# EAGLE design CAN Cape v2.1 (EAGLE 6.2)

## Sheet 1 of 3: Beagle Bone Black
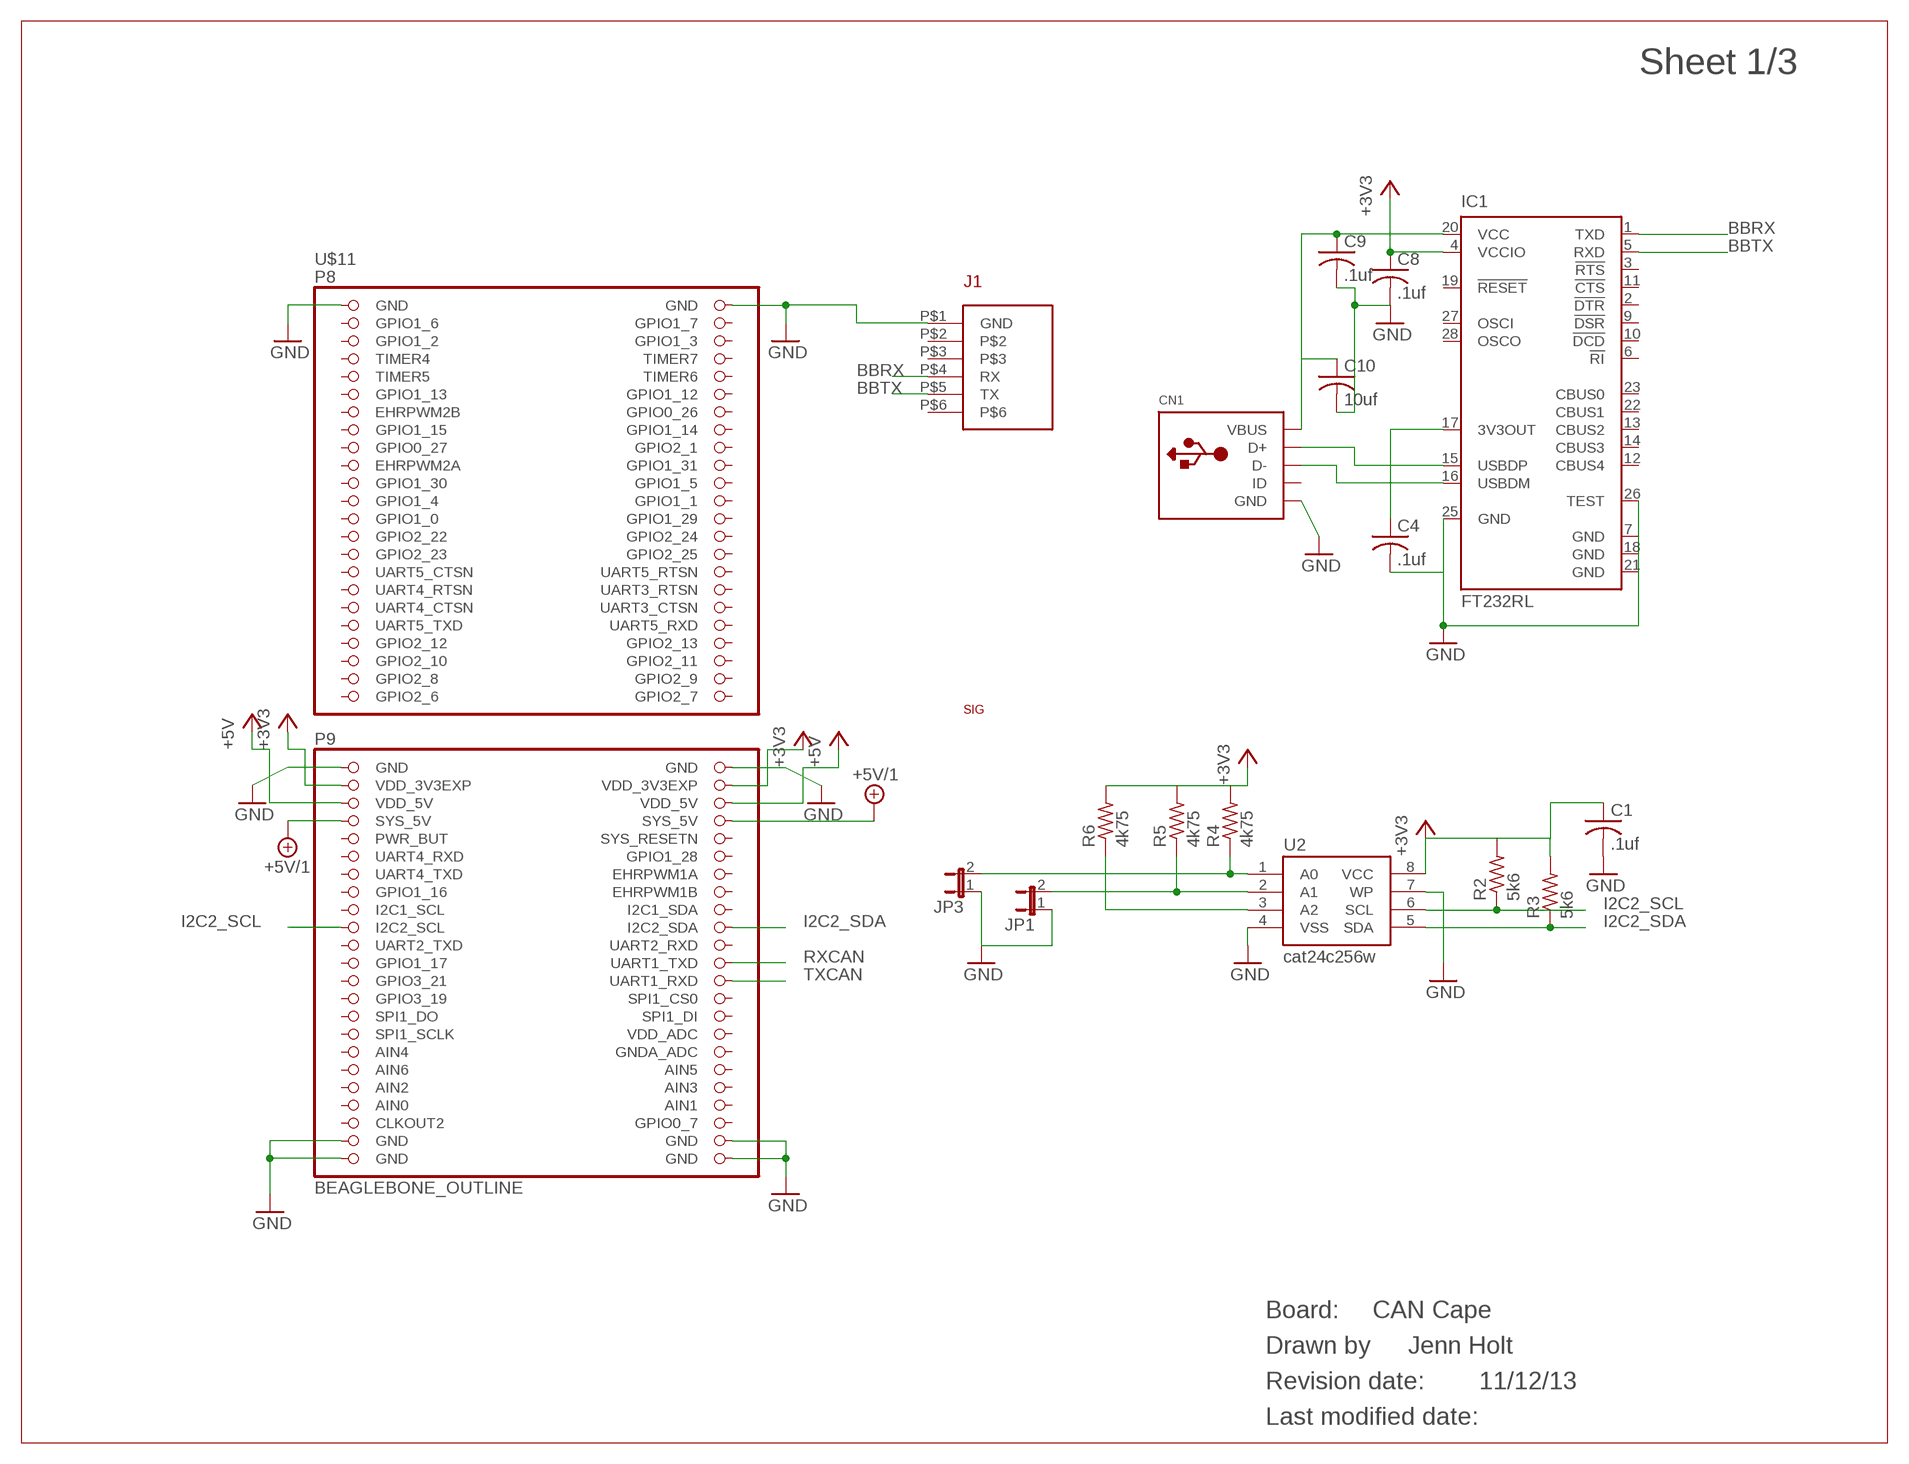
[diagram p0: schematic, sheet 1]

### Parts
C1  .1uf  C-USC0603  [C0603]
C4  .1uf  C-USC0603  [C0603]
C8  .1uf  C-USC0603  [C0603]
C9  .1uf  C-USC0603  [C0603]
C10  10uf  C-USC0805  [C0805]
CN1  USBMINIB  [USB-MINIB]
IC1  FT232RL  [SSOP28]
JP1  JUMPER-2SMD-NO  [SJ_2S-NO]
JP3  JUMPER-2SMD-NO  [SJ_2S-NO]
R2  5k6  R-US_R0603  [R0603]
R3  5k6  R-US_R0603  [R0603]
R4  4k75  R-US_R0603  [R0603]
R5  4k75  R-US_R0603  [R0603]
R6  4k75  R-US_R0603  [R0603]
U2  cat24c256w  EEPROM-I2CSMD  [SO08]
U$5  SIG  [SIG]
U$10  CURRENT-C-LETTER-LANDSCAPE  [BLANK]
U$11  BEAGLEBONE_OUTLINE  [BEAGLEBONE_SHIELD]

### Nets
+3V3: C1.1 C8.1 IC1.4(VCCIO) R2.2 R3.2 R4.2 R5.2 R6.2 U2.8(VCC) U$11.49(VDD_3V3EXP) U$11.50(VDD_3V3EXP) ; also sheet 2,3
+5V: U$11.51(VDD_5V) U$11.52(VDD_5V) ; also sheet 3
+5V/1: U$11.53(SYS_5V) U$11.54(SYS_5V)
A0: JP3.2 R4.1 U2.1(A0)
A1: JP1.2 R5.1 U2.2(A1)
BBRX: IC1.1(TXD) U$11.P$4(RX)
BBTX: IC1.5(RXD) U$11.P$5(TX)
GND: C1.2 C4.2 C8.2 C9.2 C10.2 CN1.GND IC1.7(GND) IC1.18(GND) IC1.21(GND) IC1.25(GND) IC1.26(TEST) JP1.1 JP3.1 U2.4(VSS) U2.7(WP) U$11.1(GND) U$11.2(GND) U$11.47(GND) U$11.48(GND) U$11.89(GND) U$11.90(GND) U$11.91(GND) U$11.92(GND) U$11.P$1(GND) ; also sheet 2,3
I2C2_SCL: R2.1 U2.6(SCL) U$11.65(I2C2_SCL)
I2C2_SDA: R3.1 U2.5(SDA) U$11.66(I2C2_SDA)
N$2: C9.1 C10.1 CN1.VBUS IC1.20(VCC)
N$4: CN1.D+ IC1.15(USBDP)
N$5: CN1.D- IC1.16(USBDM)
N$6: R6.1 U2.3(A2)
N$8: C4.1 IC1.17(3V3OUT)
RXCAN: U$11.70(UART1_TXD) ; also sheet 2
TXCAN: U$11.72(UART1_RXD) ; also sheet 2
Unconnected: CN1.ID IC1.2(!DTR) IC1.3(!RTS) IC1.6(!RI) IC1.9(!DSR) IC1.10(!DCD) IC1.11(!CTS) IC1.12(CBUS4) IC1.13(CBUS2) IC1.14(CBUS3) IC1.19(!RESET) IC1.22(CBUS1) IC1.23(CBUS0) IC1.27(OSCI) IC1.28(OSCO) U$11.3(GPIO1_6) U$11.4(GPIO1_7) U$11.5(GPIO1_2) U$11.6(GPIO1_3) U$11.7(TIMER4) U$11.8(TIMER7) U$11.9(TIMER5) U$11.10(TIMER6) U$11.11(GPIO1_13) U$11.12(GPIO1_12) U$11.13(EHRPWM2B) U$11.14(GPIO0_26) U$11.15(GPIO1_15) U$11.16(GPIO1_14) U$11.17(GPIO0_27) U$11.18(GPIO2_1) U$11.19(EHRPWM2A) U$11.20(GPIO1_31) U$11.21(GPIO1_30) U$11.22(GPIO1_5) U$11.23(GPIO1_4) U$11.24(GPIO1_1) U$11.25(GPIO1_0) U$11.26(GPIO1_29) U$11.27(GPIO2_22) U$11.28(GPIO2_24) U$11.29(GPIO2_23) U$11.30(GPIO2_25) U$11.31(UART5_CTSN) U$11.32(UART5_RTSN) U$11.33(UART4_RTSN) U$11.34(UART3_RTSN) U$11.35(UART4_CTSN) U$11.36(UART3_CTSN) U$11.37(UART5_TXD) U$11.38(UART5_RXD) U$11.39(GPIO2_12) U$11.40(GPIO2_13) U$11.41(GPIO2_10) U$11.42(GPIO2_11) U$11.43(GPIO2_8) U$11.44(GPIO2_9) U$11.45(GPIO2_6) U$11.46(GPIO2_7) U$11.55(PWR_BUT) U$11.56(SYS_RESETN) U$11.57(UART4_RXD) U$11.58(GPIO1_28) U$11.59(UART4_TXD) U$11.60(EHRPWM1A) U$11.61(GPIO1_16) U$11.62(EHRPWM1B) U$11.63(I2C1_SCL) U$11.64(I2C1_SDA) U$11.67(UART2_TXD) U$11.68(UART2_RXD) U$11.69(GPIO1_17) U$11.71(GPIO3_21) U$11.73(GPIO3_19) U$11.74(SPI1_CS0) U$11.75(SPI1_DO) U$11.76(SPI1_DI) U$11.77(SPI1_SCLK) U$11.78(VDD_ADC) U$11.79(AIN4) U$11.80(GNDA_ADC) U$11.81(AIN6) U$11.82(AIN5) U$11.83(AIN2) U$11.84(AIN3) U$11.86(AIN1) U$11.87(CLKOUT2) U$11.88(GPIO0_7) U$11.P$2 U$11.P$3 U$11.P$6

### Notes on the sheet
- CAN Cape
- Jenn Holt
- 11/12/13

## Sheet 2 of 3: CAN and Connectors
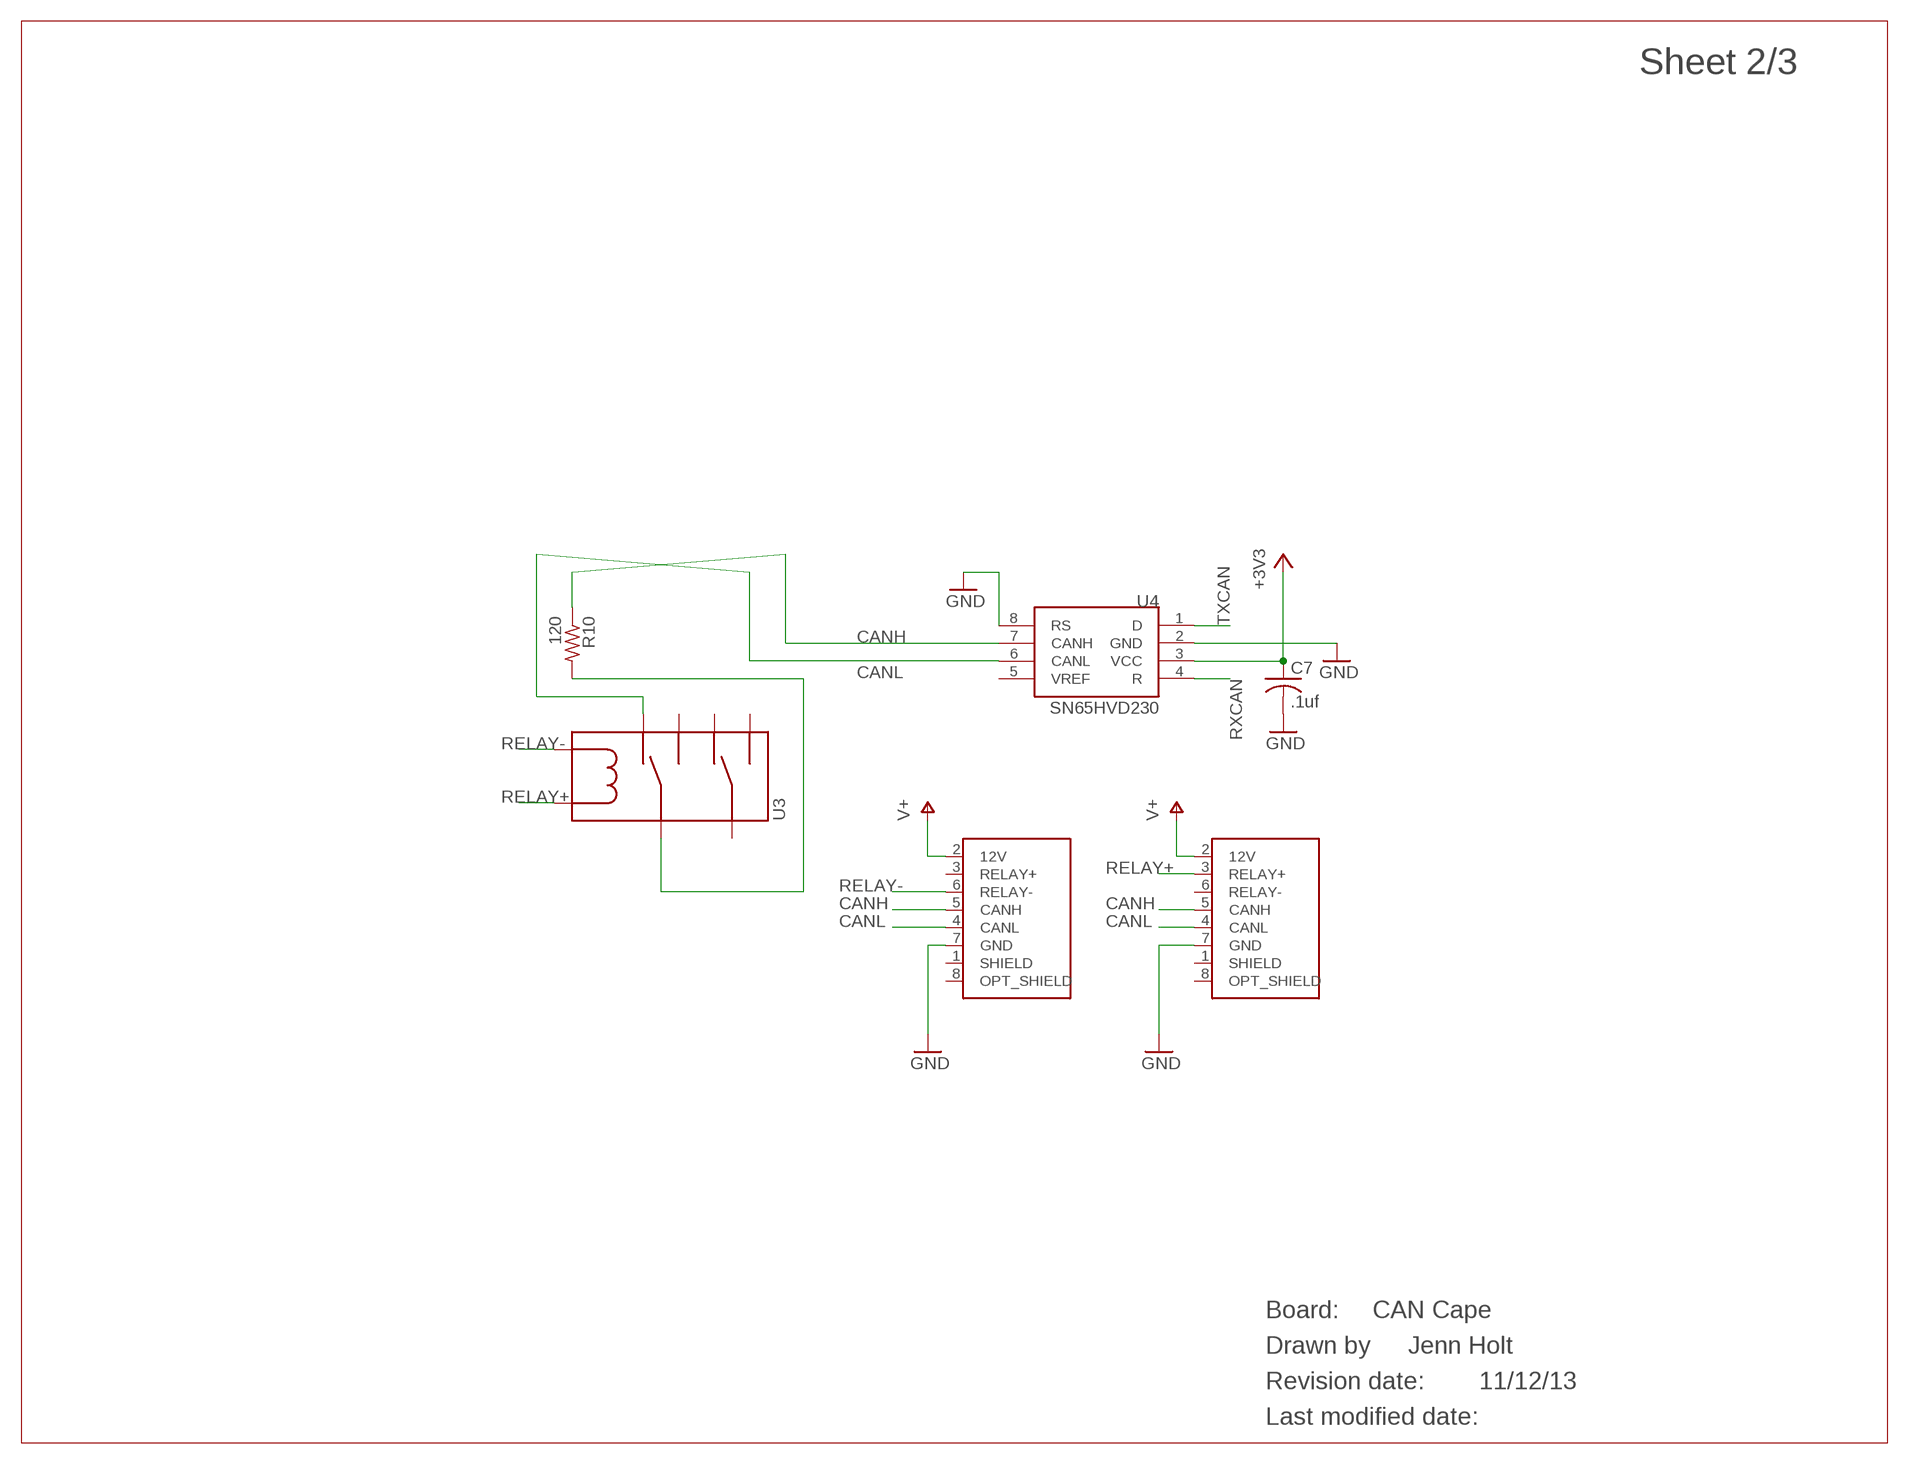
[diagram p1: schematic, sheet 2]

### Parts
C7  .1uf  C-USC0603  [C0603]
R10  120  R-US_R0603  [R0603]
U3  IM_RELAY  [IM_RELAY]
U4  SN65HVD230  [SOIC8]
U$6  CANBUS2VERT  [776276-1_AMPSEAL_8_VERT]
U$7  CANBUS2VERT  [776276-1_AMPSEAL_8_VERT]
U$9  CURRENT-C-LETTER-LANDSCAPE  [BLANK]

### Nets
+3V3: C7.1 U4.3(VCC) ; also sheet 1,3
CANH: R10.1 U4.7(CANH) U$6.5(CANH) U$7.5(CANH)
CANL: U3.2(NC1) U4.6(CANL) U$6.4(CANL) U$7.4(CANL)
GND: C7.2 U4.2(GND) U4.8(RS) U$6.7(GND) U$7.7(GND) ; also sheet 1,3
N$1: R10.2 U3.3(COM1)
RELAY+: U3.1(C1) U$7.3(RELAY+)
RELAY-: U3.8(C2) U$6.6(RELAY-)
RXCAN: U4.4(R) ; also sheet 1
TXCAN: U4.1(D) ; also sheet 1
V+: U$6.2(12V) U$7.2(12V) ; also sheet 3
Unconnected: U3.4(NO1) U3.5(NO2) U3.6(COM2) U3.7(NC2) U4.5(VREF) U$6.1(SHIELD) U$6.3(RELAY+) U$6.8(OPT_SHIELD) U$7.1(SHIELD) U$7.6(RELAY-) U$7.8(OPT_SHIELD)

### Notes on the sheet
- CAN Cape
- Jenn Holt
- 11/12/13

## Sheet 3 of 3: power
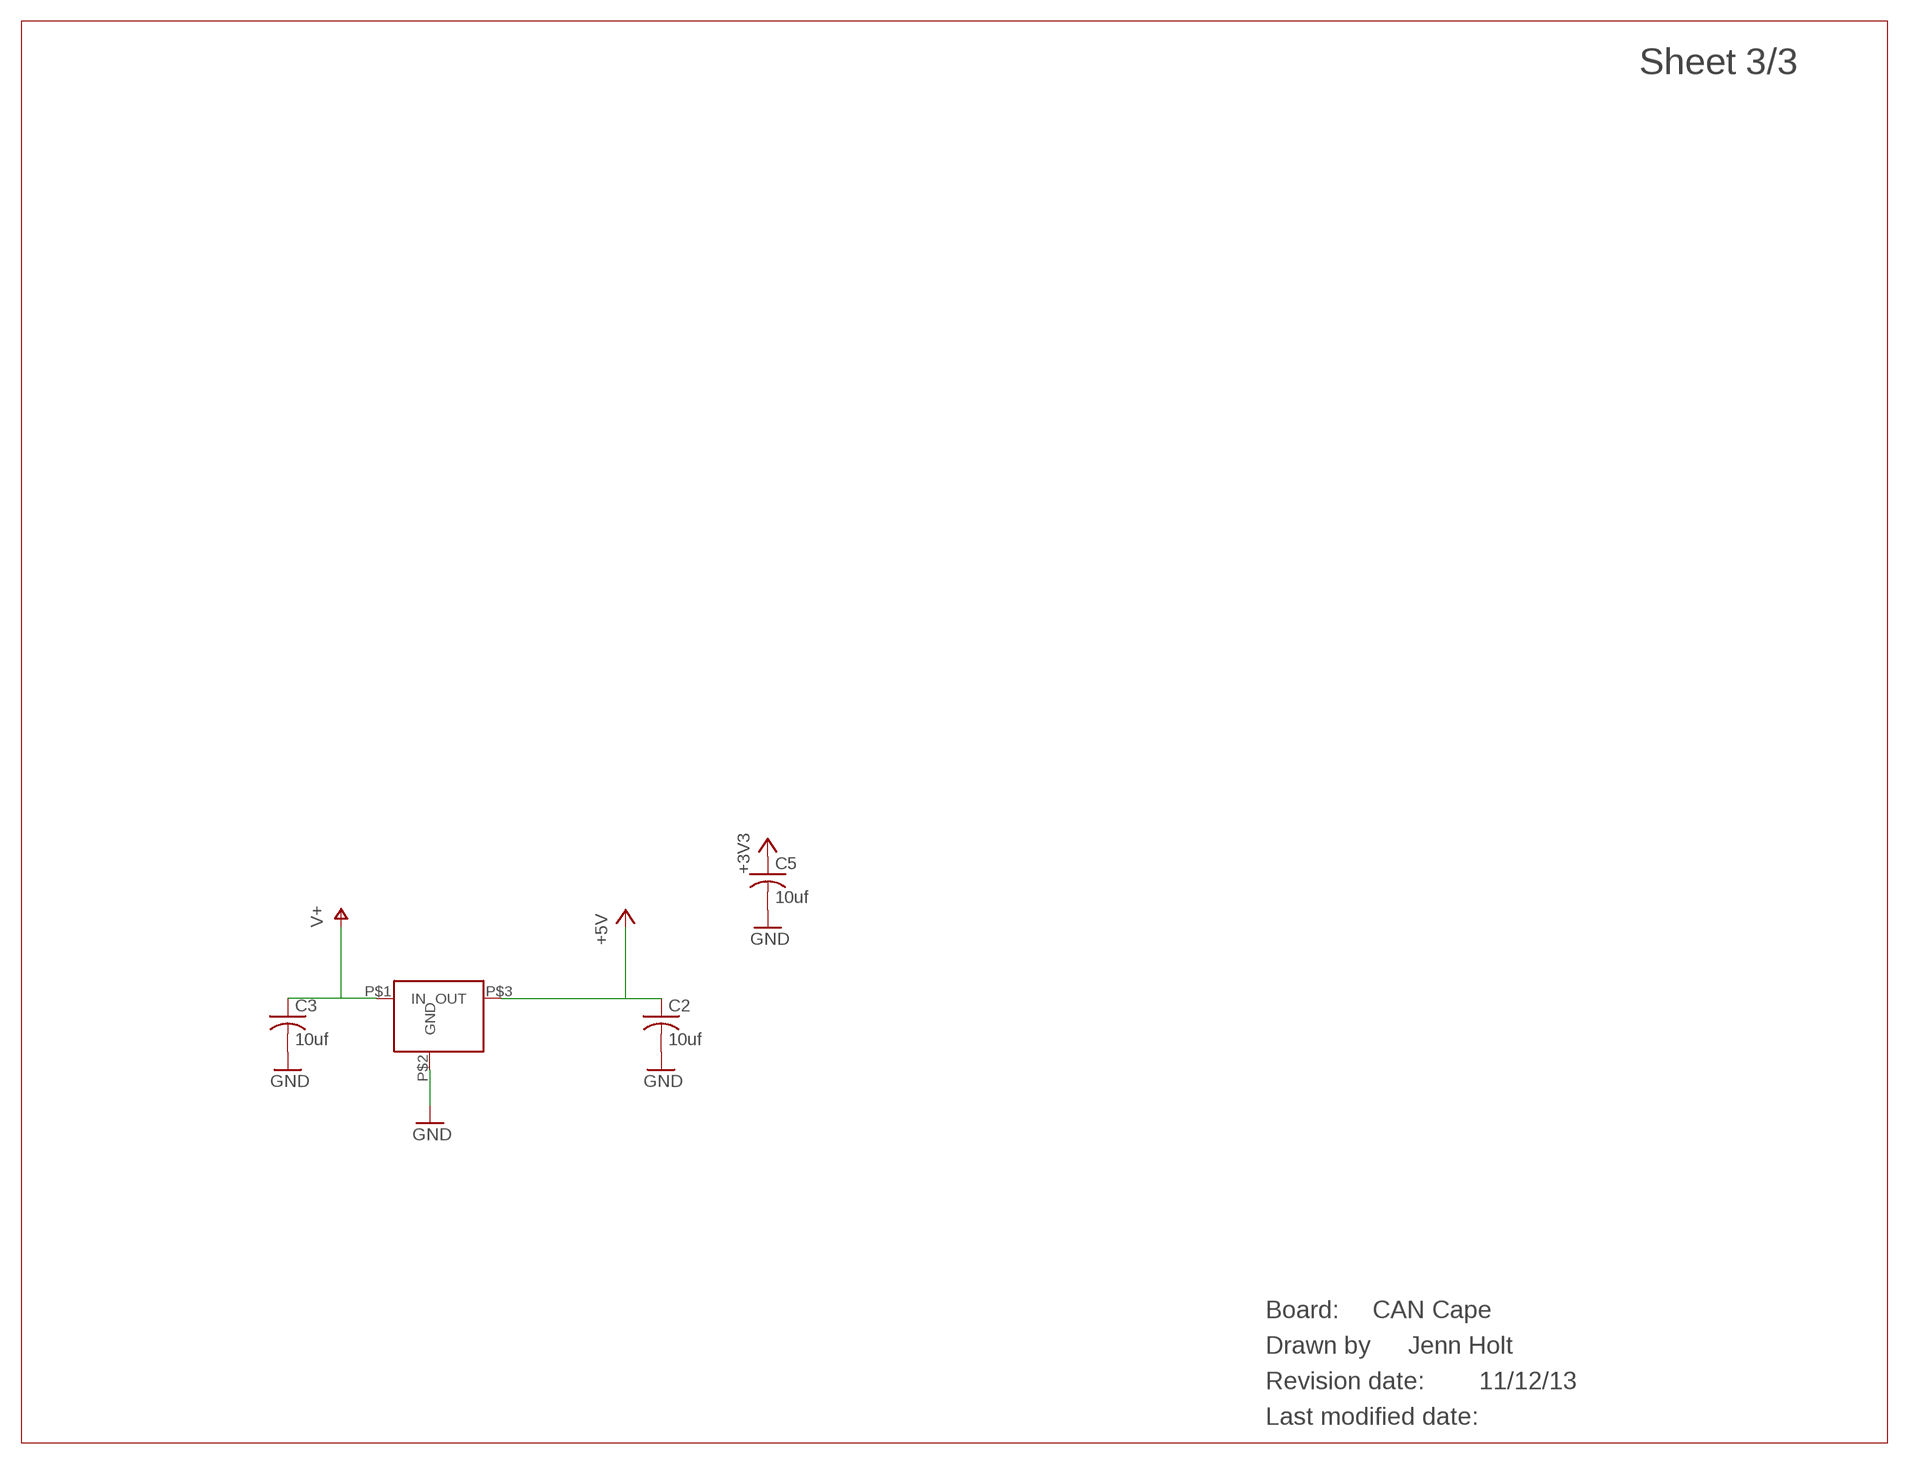
[diagram p2: schematic, sheet 3]

### Parts
C2  10uf  C-USC0805  [C0805]
C3  10uf  C-USC0805  [C0805]
C5  10uf  C-USC0805  [C0805]
U1  RECOM_DCDC  [INNOLINE-SIP]
U$4  CURRENT-C-LETTER-LANDSCAPE  [BLANK]

### Nets
+3V3: C5.1 ; also sheet 1,2
+5V: C2.1 U1.P$3(OUT) ; also sheet 1
GND: C2.2 C3.2 C5.2 U1.P$2(GND) ; also sheet 1,2
V+: C3.1 U1.P$1(IN) ; also sheet 2

### Notes on the sheet
- CAN Cape
- Jenn Holt
- 11/12/13

## Power pins joined to a net without a drawn wire
AIN0: U$11.85(AIN0)

## Library data of the parts
C1 C4 C7-C9 = rcl:C-US: CAPACITOR, American symbol; PARTNO: C1608X7R1E104K080AA
C2 C3 C5 C10 = rcl:C-US: CAPACITOR, American symbol; PARTNO: GRM21BR61C106KE15L
CN1 = adafruit:USB: USB Connectors USBMINIB - Surface Mount Female Mini-B USB Connector 4UConnector: 06564 By microbuilder.eu Thru-hole RA Female Mini-B USB Connector 4UConnector: 18732 By ladyada.net; PARTNO: 1734035-2
IC1 = ftdichip:FT232R: Source: http://www.ftdichip.com/Documents/DataSheets/DS_FT232R_v104.pdf; MPN: FT232RL; OC_FARNELL: 1146032; OC_NEWARK: 91K9918; PARTNO: FT232RL
JP1 JP3 = SparkFun:JUMPER-2: Jumper Basic 0.1" spaced jumper. Use with breakaway headers.
R2-R6 = rcl:R-US_: RESISTOR, American symbol; PARTNO: ERJ-3EKF4701V
R10 = rcl:R-US_: RESISTOR, American symbol; PARTNO: RC0805FR-07120RL
U1 = jenn:RECOM_DCDC: RECOM Innoline 78xx series dc-dc converters 1A output part number R-78xxx-1.0 where xxx=1.8,2.5,3.3,5.0 (Volts); PARTNO: R-78C5.0-1.0
U2 = SparkFun:EEPROM-I2C; PARTNO: CAT24C256WI-GT3
U3 = TE-Jenn:IM_RELAY: DPDT IM style relay.; PARTNO: IM26GR
U4 = BMC components:SN65HVD230; PARTNO: SN65HVD230D
U$4 U$9 U$10 = Frames-v6:CURRENT-C-LETTER-LANDSCAPE
U$5 = jenn:SIG
U$6 U$7 = TE-Jenn:CANBUS2; PARTNO: 1-776276-1
U$11 = adafruit:BEAGLEBONE_OUTLINE: Should match A3 pinout - but not completely tested

## Board
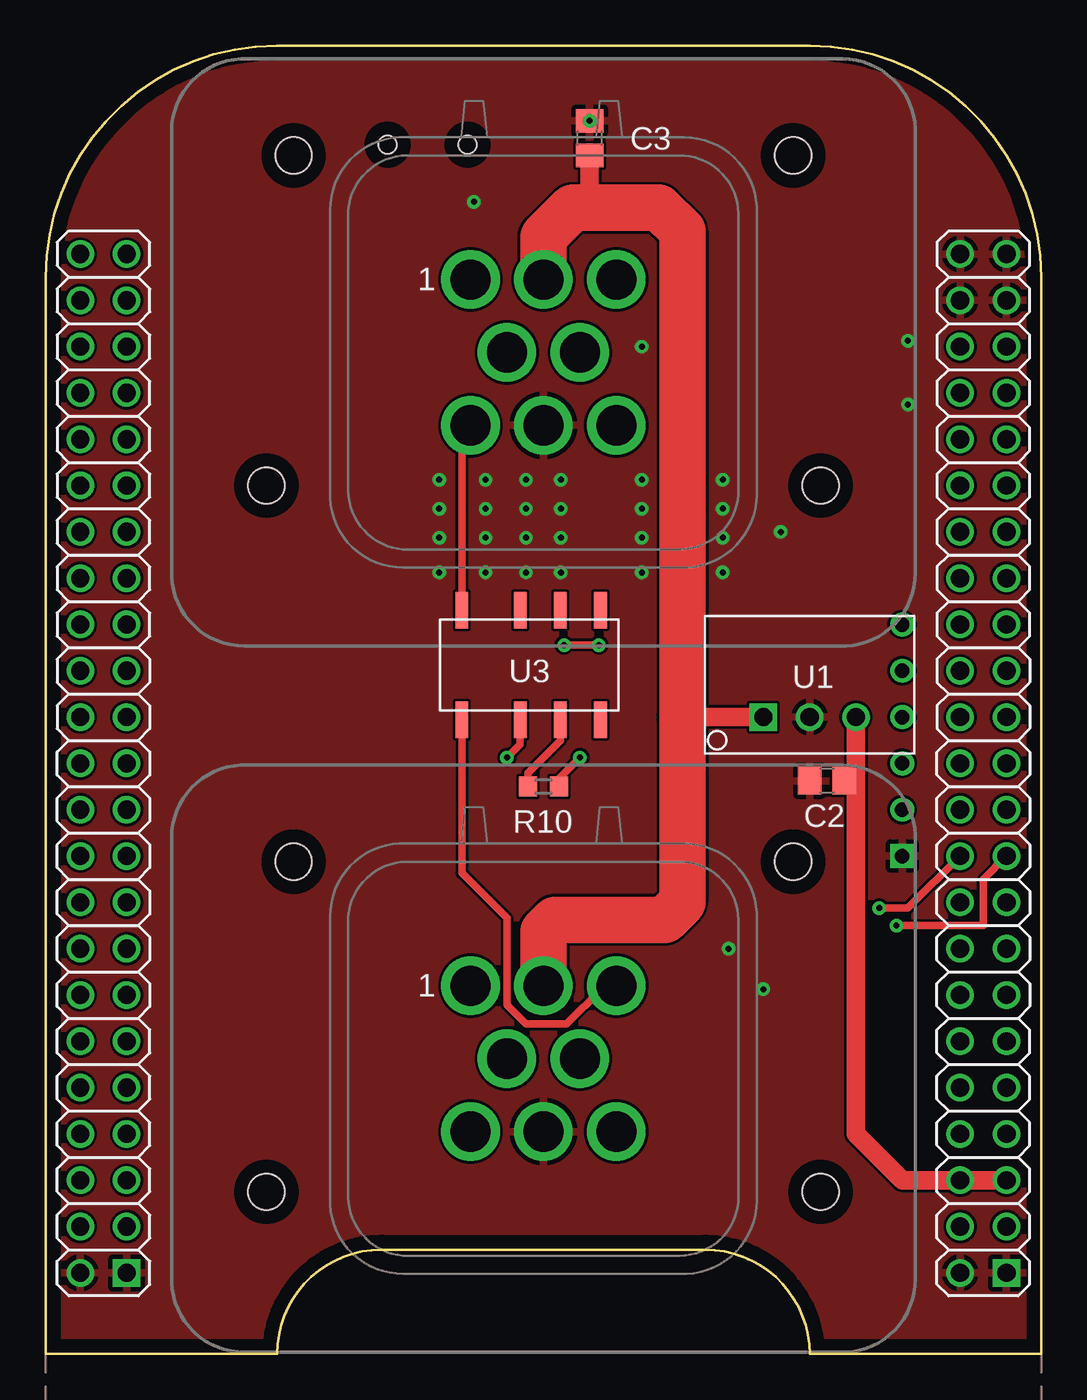
[diagram p3: board, top side]
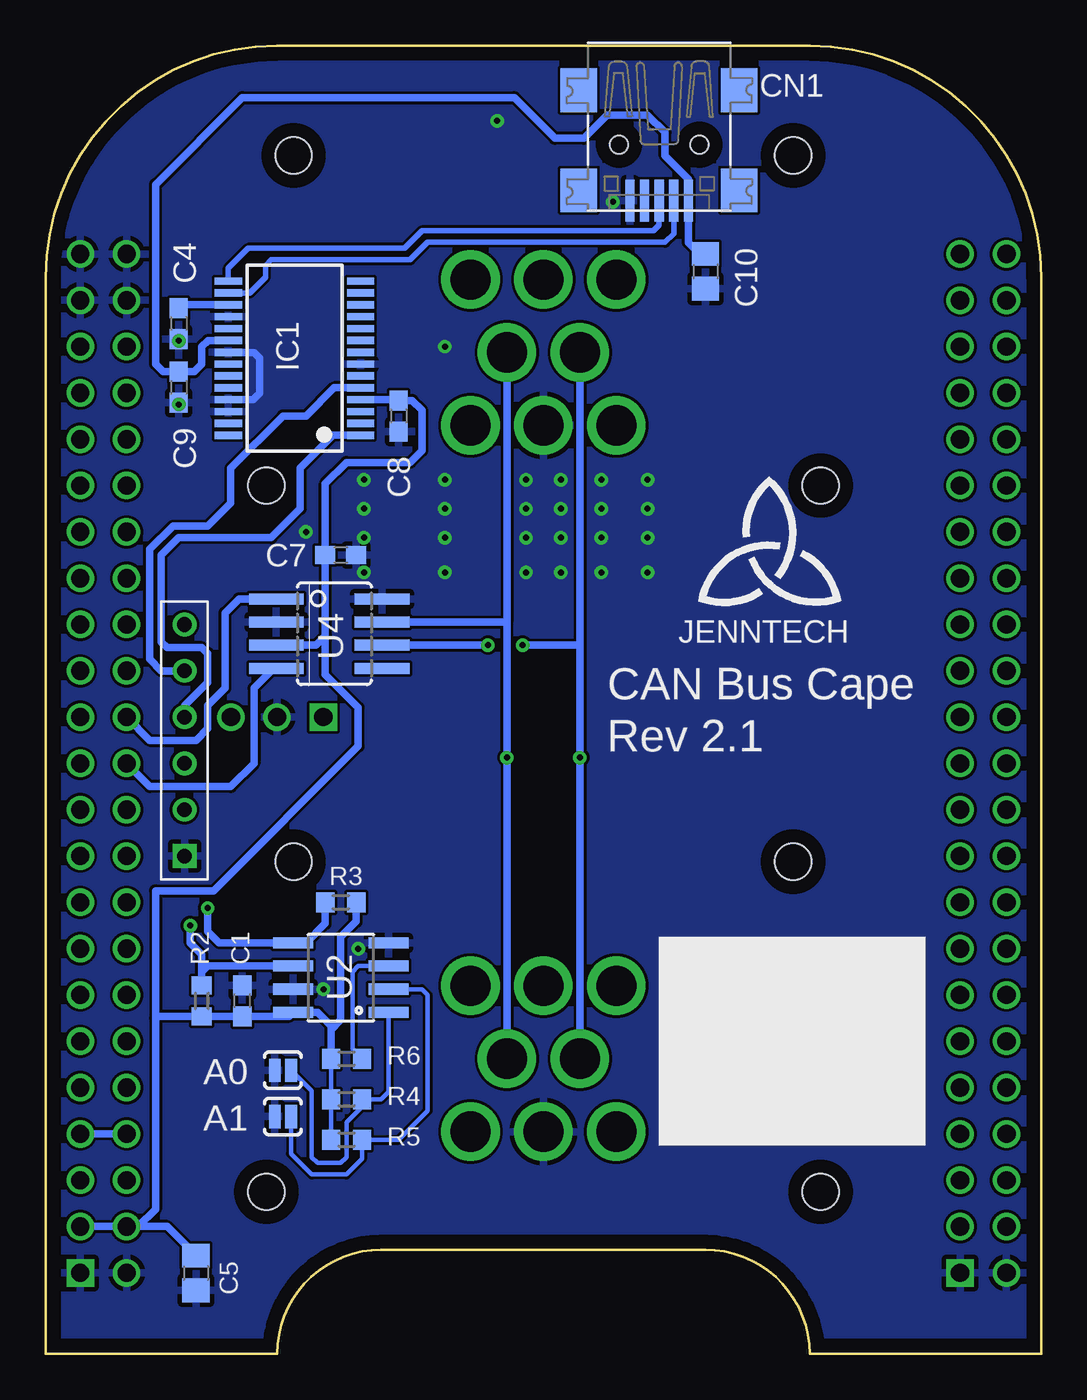
[diagram p4: board, bottom side, seen from below]

Size 54.61 x 71.75 mm. Coordinates in mm from the lower left corner, seen from the top.
Copper layers (1*16): Top 0.035mm / dielectric 1.5mm / Bottom 0.035mm
Design rules: minimum track width 6mil, minimum drill 13mil, track to track 6mil, track to pad 6mil, pad to pad 6mil, via to via 6mil, smd to smd 0mil, copper to edge 30mil, drill to drill 8mil, minimum pad ring 10mil, minimum via ring 8mil, stop-mask expansion 4mil, vias tented up to drill 13mil, thermal gap 10mil

### Footprints (pad centres in the part's own frame; a part is rotated, then mirrored left to right if it is on the bottom)
C0603 = smd 1.1 x 1: 1 -0.85,0; 2 0.85,0
C0805 = smd 1.3 x 1.5: 1 -0.95,0; 2 0.95,0
USB-MINIB = smd 0.5 x 2.308: D+ 0,4.064; D- -0.8,4.064; GND 1.6,4.064; ID 0.8,4.064; VBUS -1.6,4.064 | smd 2 x 2.4: GND1 -4.4,-2; GND2 -4.4,3.5; GND3 4.4,3.5; GND4 4.4,-2 | hole 1: -2.2,1; 2.2,1
SSOP28 = smd 0.4 x 1.5: 1 -4.225,-3.625; 2 -3.575,-3.625; 3 -2.925,-3.625; 4 -2.275,-3.625; 5 -1.625,-3.625; 6 -0.975,-3.625; 7 -0.325,-3.625; 8 0.325,-3.625; 9 0.975,-3.625; 10 1.625,-3.625; 11 2.275,-3.625; 12 2.925,-3.625; 13 3.575,-3.625; 14 4.225,-3.625; 15 4.225,3.625; 16 3.575,3.625; 17 2.925,3.625; 18 2.275,3.625; 19 1.625,3.625; 20 0.975,3.625; 21 0.325,3.625; 22 -0.325,3.625; 23 -0.975,3.625; 24 -1.625,3.625; 25 -2.275,3.625; 26 -2.925,3.625; 27 -3.575,3.625; 28 -4.225,3.625
SJ_2S-NO = smd 0.635 x 1.27: 1 -0.45,0; 2 0.45,0
R0603 = smd 1 x 1.1: 1 -0.85,0; 2 0.85,0
INNOLINE-SIP = drill 1 square: P$1 -2.54,0 | drill 1: P$2 0,0; P$3 2.54,0
SO08 = smd 0.61 x 2.21: 1 -1.905,-2.616; 2 -0.635,-2.616; 3 0.635,-2.616; 4 1.905,-2.616; 5 1.905,2.616; 6 0.635,2.616; 7 -0.635,2.616; 8 -1.905,2.616
IM_RELAY = smd 0.7 x 2: 1 -3.2,-3; 2 0,-3; 3 2.2,-3; 4 4.4,-3; 5 4.4,3; 6 2.2,3; 7 0,3; 8 -3.2,3
SOIC8 = smd 0.6 x 3: 1 0.5,-2.9; 2 1.77,-2.9; 3 3.04,-2.9; 4 4.31,-2.9; 5 4.31,2.9; 6 3.04,2.9; 7 1.77,2.9; 8 0.5,2.9
776276-1_AMPSEAL_8_VERT = drill 2.2: 1 -4,4; 2 0,4; 3 4,4; 4 -2,0; 5 2,0; 6 -4,-4; 7 0,-4; 8 4,-4 | hole 2: -13.7,10.8; 13.7,10.8; -15.2,-7.3; 15.2,-7.3
BEAGLEBONE_SHIELD = drill 1 square: 1 4.445,19.05; 47 52.705,19.05 | drill 1: 2 1.905,19.05; 3 4.445,21.59; 4 1.905,21.59; 5 4.445,24.13; 6 1.905,24.13; 7 4.445,26.67; 8 1.905,26.67; 9 4.445,29.21; 10 1.905,29.21; 11 4.445,31.75; 12 1.905,31.75; 13 4.445,34.29; 14 1.905,34.29; 15 4.445,36.83; 16 1.905,36.83; 17 4.445,39.37; 18 1.905,39.37; 19 4.445,41.91; 20 1.905,41.91; 21 4.445,44.45; 22 1.905,44.45; 23 4.445,46.99; 24 1.905,46.99; 25 4.445,49.53; 26 1.905,49.53; 27 4.445,52.07; 28 1.905,52.07; 29 4.445,54.61; 30 1.905,54.61; 31 4.445,57.15; 32 1.905,57.15; 33 4.445,59.69; 34 1.905,59.69; 35 4.445,62.23; 36 1.905,62.23; 37 4.445,64.77; 38 1.905,64.77; 39 4.445,67.31; 40 1.905,67.31; 41 4.445,69.85; 42 1.905,69.85; 43 4.445,72.39; 44 1.905,72.39; 45 4.445,74.93; 46 1.905,74.93; 48 50.165,19.05; 49 52.705,21.59; 50 50.165,21.59; 51 52.705,24.13; 52 50.165,24.13; 53 52.705,26.67; 54 50.165,26.67; 55 52.705,29.21; 56 50.165,29.21; 57 52.705,31.75; 58 50.165,31.75; 59 52.705,34.29; 60 50.165,34.29; 61 52.705,36.83; 62 50.165,36.83; 63 52.705,39.37; 64 50.165,39.37; 65 52.705,41.91; 66 50.165,41.91; 67 52.705,44.45; 68 50.165,44.45; 69 52.705,46.99; 70 50.165,46.99; 71 52.705,49.53; 72 50.165,49.53; 73 52.705,52.07; 74 50.165,52.07; 75 52.705,54.61; 76 50.165,54.61; 77 52.705,57.15; 78 50.165,57.15; 79 52.705,59.69; 80 50.165,59.69; 81 52.705,62.23; 82 50.165,62.23; 83 52.705,64.77; 84 50.165,64.77; 85 52.705,67.31; 86 50.165,67.31; 87 52.705,69.85; 88 50.165,69.85; 89 52.705,72.39; 90 50.165,72.39; 91 52.705,74.93; 92 50.165,74.93 | drill 0.8 square: P$1 46.99,41.91 | drill 0.8: P$2 46.99,44.45; P$3 46.99,46.99; P$4 46.99,49.53; P$5 46.99,52.07; P$6 46.99,54.61

### Placement (x,y rotation side)
C1  43.81,19.37 90 bottom
C2  42.86,31.43 180 top
C3  29.84,66.67 90 top
C4  47.31,56.52 270 bottom
C5  46.35,4.45 270 bottom
C7  38.42,43.81 0 bottom
C8  35.24,51.44 270 bottom
C9  47.31,53.02 270 bottom
C10  18.41,59.37 270 bottom
CN1  20.95,67.31 180 bottom
IC1  40.96,54.61 90 bottom
JP1  41.59,13.02 0 bottom
JP3  41.59,15.56 0 bottom
R2  46.04,19.37 270 bottom
R3  38.42,24.76 0 bottom
R4  38.1,13.97 180 bottom
R5  38.1,11.75 180 bottom
R6  38.1,16.19 180 bottom
R10  27.3,31.11 180 top
U1  41.91,34.92 0 top
U2  38.42,20.64 90 bottom
U3  26.04,37.78 0 top
U4  39.05,41.91 270 bottom
U$4  -3.17,-39.69 0 top  (outside the outline)
U$5  14.92,43.5 0 bottom
U$6  27.3,54.93 0 top
U$7  27.3,16.19 0 top
U$9  -2.22,-38.42 0 top  (outside the outline)
U$10  -4.13,-40.96 0 top  (outside the outline)
U$11  0,-14.61 0 top

### Tracks (layer width: path | path; a pad name or v marks a point on that pad's centre or on a via)
+3V3
  Bottom 0.254: R6.2 R4.2 R5.2
  Bottom 0.406: 49.53,6.98 47.94,6.98 C5.1 | 39.27,39.37 C7.1 39.27,47.73 38.1,48.89 34.61,48.89 33.97,49.53 33.97,51.75 34.51,52.28 C8.1 35.29,52.33 IC1.4 | 39.27,39.37 39.27,37.25 37.47,35.45 37.47,33.34 45.4,25.4 48.58,25.4 48.58,18.42 | U4.3 39.77,38.87 39.27,39.37 | 48.58,18.42 48.58,7.94 49.53,6.98 | 48.58,18.42 48.48,18.52 R2.2 C1.1 41.25,18.52 U2.8 39.69,18.73 38.95,18 38.95,17.78 | R6.2 38.95,17.78 | R3.2 37.57,23.71 38.42,22.86 38.42,18.31 38.95,17.78 | U$11.49 U$11.50 49.53,6.98
+5V
  Top 1.016: U1.P$3 44.45,31.43 | 44.45,31.43 44.45,12.07 46.99,9.52 U$11.52 U$11.51 | C2.1 44.45,31.43
+5V/1
  Bottom 0.406: U$11.54 U$11.53
A0
  Bottom 0.254: U2.1 35.8,14.36 36.2,13.97 R4.1 37.25,13.55 38.1,12.7 38.1,10.79 38.42,10.48 39.69,10.48 40.01,10.79 40.01,14.42 JP3.2
A1
  Bottom 0.254: U2.2 33.97,20 33.66,19.68 33.66,13.34 35.24,11.75 R5.1 37.25,10.69 38.1,9.84 40.01,9.84 41.14,10.98 JP1.2
BBRX
  Bottom 0.406: U$11.P$4 46.99,35.56 45.72,36.83 45.72,38.42 46.04,38.73 47.94,38.73 48.26,39.05 48.26,43.81 47.31,44.77 42.23,44.77 40.64,46.36 40.64,48.58 38.83,50.38 IC1.1
BBTX
  Bottom 0.406: U$11.P$5 48.26,37.47 48.9,38.1 48.9,44.13 47.62,45.4 45.72,45.4 44.45,46.67 44.45,48.58 41.59,51.44 40.32,51.44 38.77,52.98 IC1.5
CANH  (via drill 0.33)
  Top 0.406: R10.1 28.16,31.55 v29.3,32.7
  Bottom 0.406: U$6.5 29.3,40.14 | U$7.5 v29.3,32.7 29.3,40.14 | U4.7 29.3,40.14
CANL  (via drill 0.33)
  Top 0.406: v30.34,38.87 v28.44,38.87 | U3.2 26.04,33.43 v25.3,32.7
  Bottom 0.406: U$6.4 25.3,38.87 | U$7.4 v25.3,32.7 25.3,38.87 | U4.6 v30.34,38.87 | v28.44,38.87 25.3,38.87
GND  (via drill 0.33)
  Bottom 0.406: IC1.25 43.23,52.33 42.86,52.7 42.86,54.61 43.18,54.93 IC1.21
  other vias: 29.84,67.63 26.35,47.94 28.26,47.94 26.35,46.36 28.26,46.36 26.35,44.77 28.26,44.77 26.35,42.86 28.26,42.86 32.7,42.86 32.7,44.77 32.7,46.36 32.7,47.94 24.13,47.94 24.13,46.36 24.13,44.77 24.13,42.86 21.59,47.94 21.59,46.36 21.59,44.77 21.59,42.86 37.15,47.94 37.15,46.36 37.15,44.77 37.15,42.86 39.37,20 37.47,22.22 23.5,63.18 47.31,55.56 47.31,52.07 40.32,45.08 32.7,55.24
  pour Bottom (rank 2): -2.22,72.07 55.88,72.07 55.88,-1.59 -2.22,-1.59 -2.22,71.75
  pour Top (rank 2): 55.88,-1.59 -2.22,-1.59 -2.22,72.07 55.88,72.07
I2C2_SCL  (via drill 0.33)
  Top 0.406: v46.67,23.5 51.44,23.5 51.44,26.04 U$11.65
  Bottom 0.406: U2.6 45.72,21.27 46.04,20.96 | 46.04,20.96 R2.1 | 46.04,20.96 46.04,21.91 46.67,22.54 v46.67,23.5
I2C2_SDA  (via drill 0.33)
  Top 0.406: v45.72,24.45 47.31,24.45 U$11.66
  Bottom 0.254: 40.32,22.54 U2.5
  Bottom 0.406: R3.1 39.27,23.6 40.32,22.54 | U2.5 45.09,22.54 45.72,23.18 v45.72,24.45
N$1
  Top 0.406: U3.3 28.23,33.63 26.45,31.85 R10.2
N$2
  Bottom 0.406: IC1.20 45.7,55.58 46.04,55.24 46.04,54.29 46.46,53.87 C9.1 48.16,53.87 48.58,54.29 48.58,64.13 43.81,68.9 28.89,68.9 26.67,66.67 25.08,66.67 23.81,67.94 21.59,67.94 20.64,66.99 20.64,65.72 19.36,64.44 CN1.VBUS 19.36,60.95 18.73,60.33 C10.1
N$4
  Bottom 0.305: IC1.15 44.58,59.56 43.5,60.64 34.92,60.64 33.97,61.59 21.27,61.59 20.95,61.91 CN1.D+
N$5
  Bottom 0.305: IC1.16 43.41,58.19 42.55,59.05 42.55,59.69 42.23,60.01 34.61,60.01 33.66,60.96 20.64,60.96 20.16,61.44 CN1.D-
N$6
  Bottom 0.254: U2.3 37.47,21.27 37.78,20.96 37.78,16.72 R6.1
N$8
  Bottom 0.406: IC1.17 46.82,57.53 C4.1
RELAY+
  Top 0.406: U3.1 22.84,26.38 25.3,23.91 25.3,19.14 26.35,18.1 28.57,18.1 30.48,20 31.11,20 U$7.3
RELAY-
  Top 0.406: U3.8 22.84,50.46 U$6.6
RXCAN
  Bottom 0.406: U4.4 42.09,37.6 43.18,36.51 43.18,32.39 44.45,31.11 48.9,31.11 U$11.70
TXCAN
  Bottom 0.406: U$11.72 48.9,33.66 46.35,33.66 45.72,34.29 45.72,35.56 44.77,36.51 44.77,40.64 44,41.41 U4.1
V+
  Top 1.016: U1.P$1 34.92,34.92 | C3.1 29.84,63.82 28.57,62.55
  Top 2.54: U$6.2 27.3,61.28 28.57,62.55 28.89,62.86 33.66,62.86 34.92,61.59 34.92,34.92 34.92,24.76 33.97,23.81 27.94,23.81 27.3,23.18 U$7.2

### Text on the board
bPlace: CAN Bus Cape | Rev 2.1
tNames: C3 | U3 | U1 | C2
bNames: U4 | R3 | C1 | R2 | A0 | R6 | R4 | A1 | R5 | C5